# Altium schematic sheet imu_69.SchDoc: imu_69
size 285 x 210 mm; COMPANY: ADAFRUIT INDUSTRIES; DRAWN: KTOWN; REV: A; Origin: Eagle; Date: 11/30/2021 1:21:28 PM; SheetNumber: 1; Author: >AUTHOR; GateName_1: G$1; SymbolName_1: FRAME_A4_ADAFRUIT; LibraryName: microbuilder; DeviceSetName: FRAME_A4_ADAFRUIT; Sheet: Sheet:; AdafruitIndustries: Adafruit Industries; Drawing: Drawing:
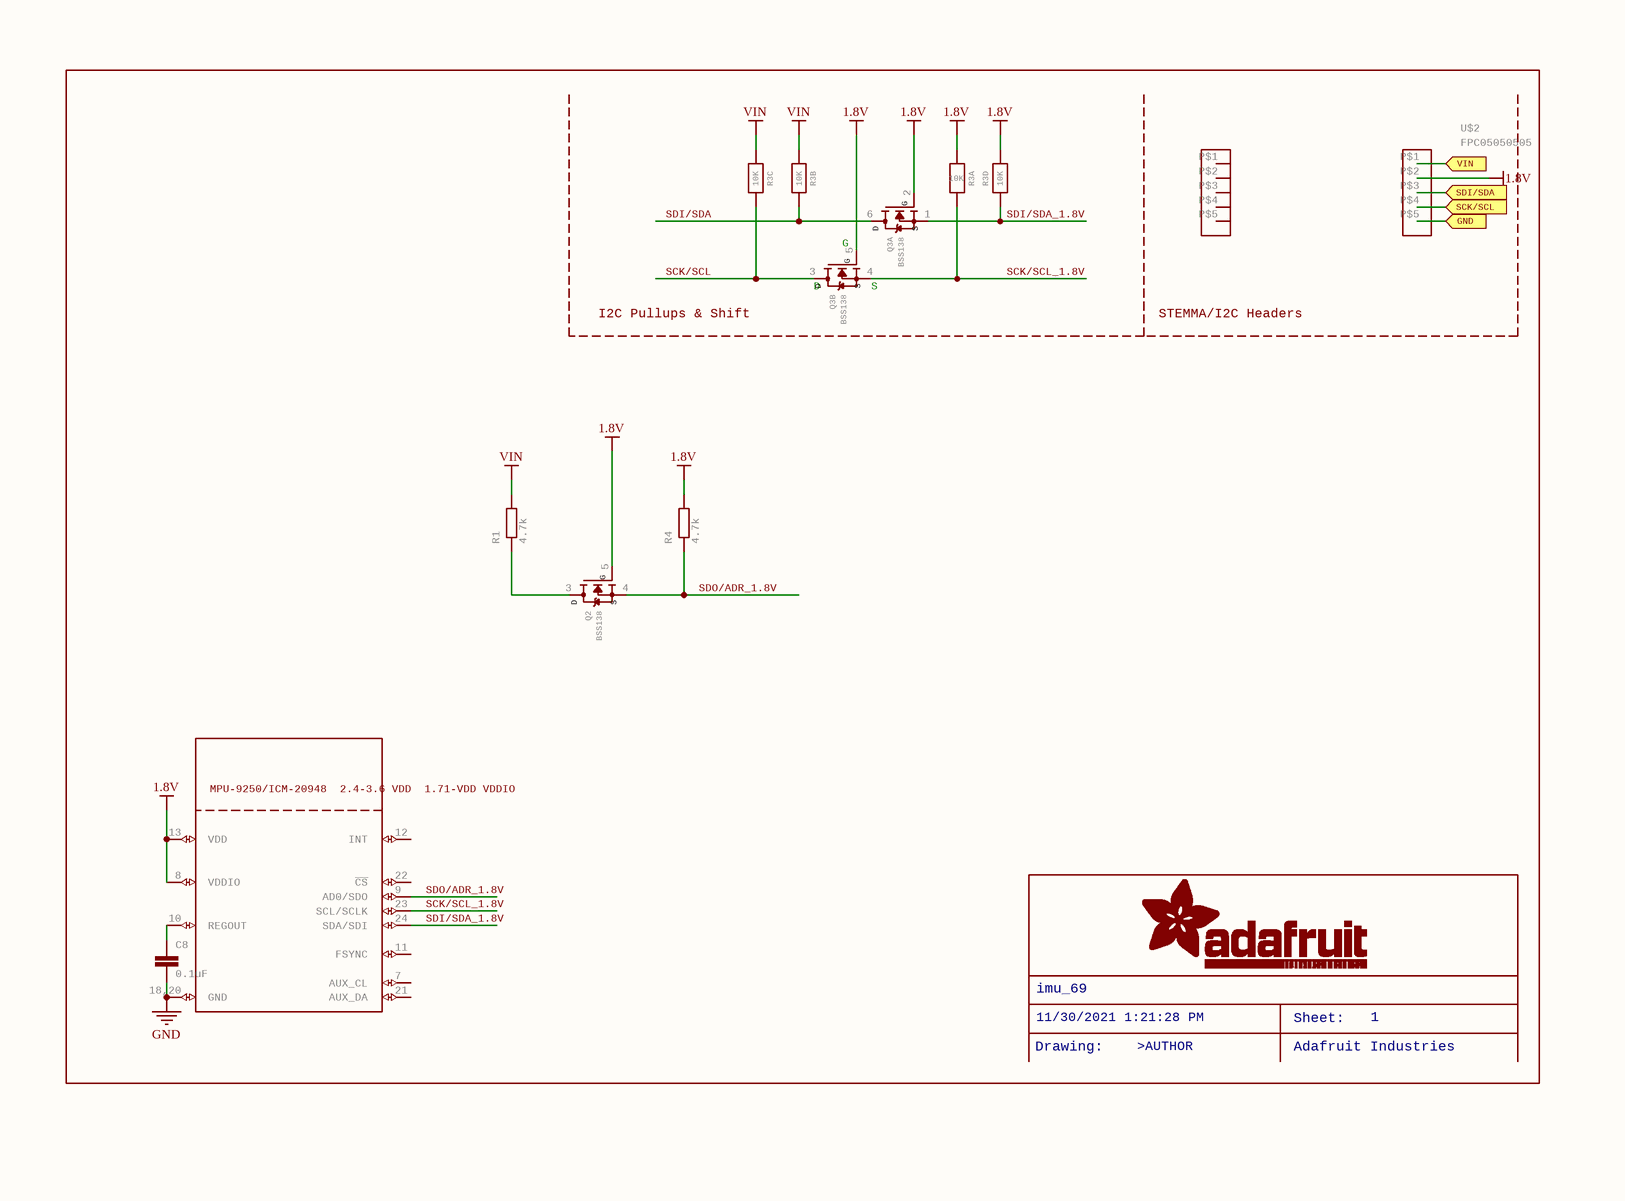
[diagram p0: imu_69.SchDoc]

## Parts
C8  0.1uF  [C0201]
Q2  BSS138  [SOT363]
Q3  BSS138  [SOT363]  (parts A,B of 2)
R1  4.7k  [R0402]
R3  10K  [RESPACK_4X0603]  (parts A,B,C,D of 4)
R4  4.7k  [R0402]
U$1  FPC05050505  [FPB0505]  (value not drawn)
U$2  FPC05050505  [FPB0505]
U$21  MPU-9250/ICM-20948
2.4-3.6VDD
1.71-VDDVDDIO: MPU-9250/ICM-20948 / 2.4-3.6 VDD / 1.71-VDD VDDIO  [QFN24_3MM_NOEP]  (hidden comment: MPU-9250_ICM20948)

## Ports
GND (in), SCK/SCL (in), SDI/SDA (in), VIN (in)

## Nets
1.8V: Q2.5(G) Q3.2(G) Q3.5(G) R3.4 R3.8 R4.2 U$2.P$2 U$21.8(VDDIO) U$21.13(VDD)
GND: C8.2 U$21.18,20(GND)
VIN: R1.2 R3.2 R3.3
GND: U$2.P$5 ; port GND  [a separate net that carries the same name]
SCK/SCL: U$2.P$4 ; port SCK/SCL
SCK/SCL: Q3.3(D) R3.6  [a separate net that carries the same name]
SCK/SCL_1.8V: Q3.4(S) R3.1 U$21.23(SCL/SCLK)
SDI/SDA: U$2.P$3 ; port SDI/SDA
SDI/SDA: Q3.6(D) R3.7  [a separate net that carries the same name]
SDI/SDA_1.8V: Q3.1(S) R3.5 U$21.24(SDA/SDI)
SDO/ADR_1.8V: Q2.4(S) R4.1 U$21.9(AD0/SDO)
VIN: U$2.P$1 ; port VIN  [a separate net that carries the same name]
NetC8_1: C8.1 U$21.10(REGOUT)
NetQ2_3: Q2.3(D) R1.1

Not connected (* = marked no-connect by the designer): U$1 P$1 P$2 P$3 P$4 P$5; U$21 7(AUX_CL) 11(FSYNC) 12(INT) 21(AUX_DA) 22(~{CS})

## Notes on the sheet
- (near Q3) D
- (near Q3) G
- (near Q3) S
- I2C Pullups & Shift
- STEMMA/I2C Headers
- imu_69
- Drawing:
- 11/30/2021 1:21:28 PM
- >AUTHOR
- Sheet:
- Adafruit Industries
- 1

## Library data of the parts
C8 = C-EUC0201: CAPACITOR, European symbol; GateName_1: G$1; SymbolName_1: C-EU; POPULARITY: 0; DeviceName: C0201; LibraryName: rcl; DeviceSetName: C-EU; SPICEPREFIX: C
Q2 = MOSFET-N_DUAL: Dual N-Channel MOSFET   SOT363 (2.0x1.25mm) 2N7002PS - 60V, 320mA [Digikey: 568-5984-1-ND]; GateName_1: 2; SymbolName_1: MOSFET-N; LibraryName: microbuilder; DeviceSetName: MOSFET-N_DUAL; D: D; S: S; G: G
Q3 = MOSFET-N_DUAL: Dual N-Channel MOSFET   SOT363 (2.0x1.25mm) 2N7002PS - 60V, 320mA [Digikey: 568-5984-1-ND]; GateName_1: 1; GateName_2: 2; SymbolName_1: MOSFET-N; SymbolName_2: MOSFET-N; LibraryName: microbuilder; DeviceSetName: MOSFET-N_DUAL; D: D; S: S; G: G
R1 R4 = R-EU_R0402: RESISTOR, European symbol; GateName_1: G$1; SymbolName_1: R-EU; DeviceSetName: R-EU_; POPULARITY: 0; DeviceName: R0402; LibraryName: rcl; SPICEPREFIX: R
R3 = RESISTOR_4PACK: Resistor Packs (4 resistors)   4 x 0603 10K 1/16W - Digikey: YC164J-10KCT-ND; GateName_1: G$1; GateName_2: G$2; GateName_3: G$3; GateName_4: G$4; SymbolName_1: RESISTOR; SymbolName_2: RESISTOR; SymbolName_3: RESISTOR; SymbolName_4: RESISTOR; LibraryName: microbuilder; DeviceSetName: RESISTOR_4PACK
U$1 U$2 = FPC05050505: GateName_1: G$1; DeviceName: 0505; SymbolName_1: FPC0505; LibraryName: my_library; DeviceSetName: FPC0505
U$21 = MPU-9250_ICM20948: MPU-9250 3-Axis gyroscope and 3-Axis accelerometer; GateName_1: G$1; SymbolName_1: MPU-9250; DeviceName: _ICM20948; LibraryName: adafruit_sensor; DeviceSetName: MPU-9250